# EAGLE design Shield_Release_181017 (EAGLE 7.1.0)
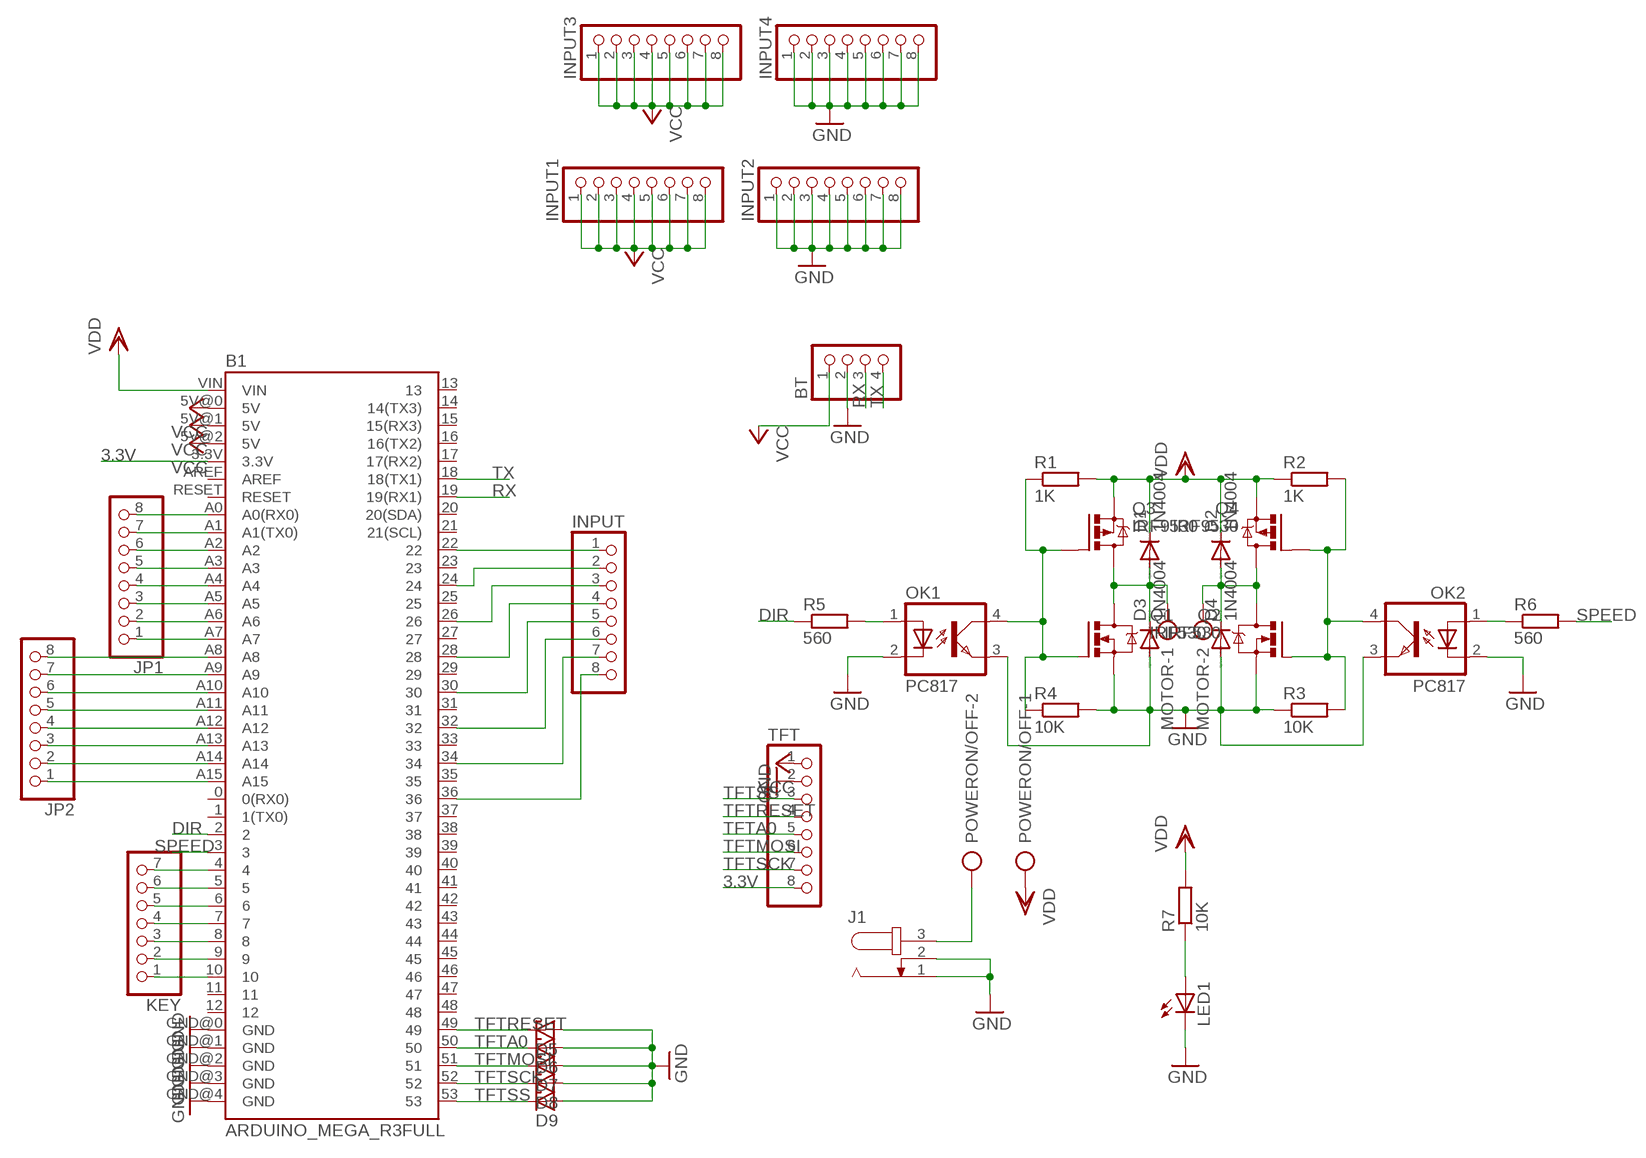
[diagram p0: schematic, sheet 1]

## Parts
B1  ARDUINO_MEGA_R3FULL  [ARDUINO_MEGA]
BT  PINHD-1X4  [1X04]
D1  1N4004  [DO41-10]
D2  1N4004  [DO41-10]
D3  1N4004  [DO41-10]
D4  1N4004  [DO41-10]
D5  ZENER-DIODEDO41Z10  [DO41Z10]
D6  ZENER-DIODEDO41Z10  [DO41Z10]
D7  ZENER-DIODEDO41Z10  [DO41Z10]
D8  ZENER-DIODEDO41Z10  [DO41Z10]
D9  ZENER-DIODEDO41Z10  [DO41Z10]
INPUT  PINHD-1X8  [1X08]
INPUT1  PINHD-1X8  [1X08]
INPUT2  PINHD-1X8  [1X08]
INPUT3  PINHD-1X8  [1X08]
INPUT4  PINHD-1X8  [1X08]
J1  JACK-PLUG0  [SPC4077]
JP1  PINHD-1X8  [1X08]
JP2  PINHD-1X8  [1X08]
KEY  PINHD-1X7  [1X07]
LED1  LED5MM  [LED5MM]
MOTOR  AK300/2  [AK300/2]
OK1  PC817  [DIL04]
OK2  PC817  [DIL04]
POWERON/OFF  AK300/2  [AK300/2]
Q1  IRF530  [TO220BV]
Q2  IRF530  [TO220BV]
Q3  IRF9530  [TO220BV]
Q4  IRF9530  [TO220BV]
R1  1K  R-EU_0204/7  [0204/7]
R2  1K  R-EU_0204/7  [0204/7]
R3  10K  R-EU_0204/7  [0204/7]
R4  10K  R-EU_0204/7  [0204/7]
R5  560  R-EU_0204/7  [0204/7]
R6  560  R-EU_0204/7  [0204/7]
R7  10K  R-EU_0204/7  [0204/7]
TFT  PINHD-1X8  [1X08]

## Nets
3.3V: B1.3.3V TFT.8
DIR: B1.2 R5.1
GND: B1.GND@0(GND) B1.GND@1(GND) B1.GND@2(GND) B1.GND@3(GND) B1.GND@4(GND) BT.2 D3.A D4.A D5.A D6.A D7.A D8.A D9.A INPUT2.1 INPUT2.2 INPUT2.3 INPUT2.4 INPUT2.5 INPUT2.6 INPUT2.7 INPUT2.8 INPUT4.1 INPUT4.2 INPUT4.3 INPUT4.4 INPUT4.5 INPUT4.6 INPUT4.7 INPUT4.8 J1.1 J1.2 LED1.K(C) OK1.2(C) OK1.3(EMIT) OK2.2(C) OK2.3(EMIT) Q1.S Q2.S R3.1 R4.2 TFT.2
N$1: OK1.4(COL) Q1.G Q3.G R1.1 R4.1
N$2: OK1.1(A) R5.2
N$3: OK2.1(A) R6.1
N$4: OK2.4(COL) Q2.G Q4.G R2.2 R3.2
N$5: B1.10 KEY.1
N$6: B1.9 KEY.2
N$7: D1.A D3.C MOTOR.1 Q1.D Q3.D
N$8: D2.A D4.C MOTOR.2 Q2.D Q4.D
N$9: B1.8 KEY.3
N$10: B1.7 KEY.4
N$11: B1.6 KEY.5
N$12: B1.5 KEY.6
N$13: B1.4 KEY.7
N$14: B1.A7 JP1.1
N$15: B1.A6 JP1.2
N$16: B1.A5 JP1.3
N$17: B1.A4 JP1.4
N$18: B1.A3 JP1.5
N$19: B1.A2 JP1.6
N$20: B1.A1(A1(TX0)) JP1.7
N$21: B1.A0(A0(RX0)) JP1.8
N$22: B1.A15 JP2.1
N$23: B1.A14 JP2.2
N$24: B1.A13 JP2.3
N$25: B1.A12 JP2.4
N$26: B1.A11 JP2.5
N$27: B1.A10 JP2.6
N$28: B1.A9 JP2.7
N$29: B1.A8 JP2.8
N$30: B1.22 INPUT.1
N$31: B1.24 INPUT.2
N$32: B1.26 INPUT.3
N$33: B1.28 INPUT.4
N$34: B1.30 INPUT.5
N$35: B1.32 INPUT.6
N$36: B1.34 INPUT.7
N$37: B1.36 INPUT.8
N$38: J1.3 POWERON/OFF.2
N$39: LED1.A R7.1
RX: B1.19(19(RX1)) BT.3
SPEED: B1.3 R6.2
TFTA0: B1.50 D6.C TFT.5
TFTMOSI: B1.51 D7.C TFT.6
TFTRESET: B1.49 D5.C TFT.4
TFTSCK: B1.52 D8.C TFT.7
TFTSS: B1.53 D9.C TFT.3
TX: B1.18(18(TX1)) BT.4
VCC: B1.5V@0(5V) B1.5V@1(5V) B1.5V@2(5V) BT.1 INPUT1.1 INPUT1.2 INPUT1.3 INPUT1.4 INPUT1.5 INPUT1.6 INPUT1.7 INPUT1.8 INPUT3.1 INPUT3.2 INPUT3.3 INPUT3.4 INPUT3.5 INPUT3.6 INPUT3.7 INPUT3.8 TFT.1
VDD: B1.VIN D1.C D2.C POWERON/OFF.1 Q3.S Q4.S R1.2 R2.1 R7.2
Unconnected: B1.0(0(RX0)) B1.1(1(TX0)) B1.11 B1.12 B1.13 B1.14(14(TX3)) B1.15(15(RX3)) B1.16(16(TX2)) B1.17(17(RX2)) B1.20(20(SDA)) B1.21(21(SCL)) B1.23 B1.25 B1.27 B1.29 B1.31 B1.33 B1.35 B1.37 B1.38 B1.39 B1.40 B1.41 B1.42 B1.43 B1.44 B1.45 B1.46 B1.47 B1.48 B1.AREF B1.RESET

## Library data of the parts
B1 = SparkFun-Boards:ARDUINO_MEGA_R3: Arduino Mega R3 ATmega2560 R3 compatible footprint. SparkFun Products: Arduino Mega 2560 R3 <https://www.sparkfun.com/products/11061>
BT = pinhead:PINHD-1X4: PIN HEADER
D1-D4 = diode:1N4004: DIODE general purpose rectifier, 1 A
D5-D9 = diode:ZENER-DIODE: Z-Diode
INPUT INPUT1-INPUT4 JP1 JP2 TFT = pinhead:PINHD-1X8: PIN HEADER
J1 = con-jack:JACK-PLUG: DC POWER JACK Power Jack, DC, Right Angle, Through Hole, Rated 5A at 16VDC, PC Terminals Distributor: Farnell (www.Farnell.de) Drawing: 84N1161.pdf / 84N1162.pdf Manufacturer: SPC Technology (www.spctechnology.com) Type: SPC4077 / SPC 4078; OC_FARNELL: unknown; OC_NEWARK: unknown
KEY = pinhead:PINHD-1X7: PIN HEADER
LED1 = led:LED: LED OSRAM: - CHIPLED LG R971, LG N971, LY N971, LG Q971, LY Q971, LO R971, LY R971 LH N974, LH R974 LS Q976, LO Q976, LY Q976 LO Q996 - Hyper CHIPLED LW Q18S LB Q993, LB Q99A, LB R99A - SideLED LS A670, LO A670, LY A670, LG A670, LP A670 LB A673, LV A673, LT A673, LW A673 LH A674 LY A675 LS A676, LA A676, LO A676, LY A676, LW A676 LS A679, LY A679, LG A679 - Hyper Micro SIDELED® LS Y876, LA Y876, LO Y876, LY Y876 LT Y87S - SmartLED LW L88C, LW L88S LB L89C, LB L89S, LG L890 LS L89K, LO L89K, LY L89K LS L896, LA L896, LO L896, LY L896 - TOPLED LS T670, LO T670, LY T670, LG T670, LP T670 LSG T670, LSP T670, LSY T670, LOP T670, LYG T670 LG T671, LOG T671, LSG T671 LB T673, LV T673, LT T673, LW T673 LH T674 LS T676, LA T676, LO T676, LY T676, LB T676, LH T676, LSB T676, LW T676 LB T67C, LV T67C, LT T67C, LS T67K, LO T67K, LY T67K, LW E67C LS E67B, LA E67B, LO E67B, LY E67B, LB E67C, LV E67C, LT E67C LW T67C LS T679, LY T679, LG T679 LS T770, LO T770, LY T770, LG T770, LP T770 LB T773, LV T773, LT T773, LW T773 LH T774 LS E675, LA E675, LY E675, LS T675 LS T776, LA T776, LO T776, LY T776, LB T776 LHGB T686 LT T68C, LB T68C - Hyper Mini TOPLED® LB M676 - Mini TOPLED Santana® LG M470 LS M47K, LO M47K, LY M47K Source: http://www.osram.convergy.de LUXEON: - LUMILED® LXK2-PW12-R00, LXK2-PW12-S00, LXK2-PW14-U00, LXK2-PW14-V00 LXK2-PM12-R00, LXK2-PM12-S00, LXK2-PM14-U00 LXK2-PE12-Q00, LXK2-PE12-R00, LXK2-PE12-S00, LXK2-PE14-T00, LXK2-PE14-U00 LXK2-PB12-K00, LXK2-PB12-L00, LXK2-PB12-M00, LXK2-PB14-N00, LXK2-PB14-P00, LXK2-PB14-Q00 LXK2-PR12-L00, LXK2-PR12-M00, LXK2-PR14-Q00, LXK2-PR14-R00 LXK2-PD12-Q00, LXK2-PD12-R00, LXK2-PD12-S00 LXK2-PH12-R00, LXK2-PH12-S00 LXK2-PL12-P00, LXK2-PL12-Q00, LXK2-PL12-R00 Source: www.luxeon.com KINGBRIGHT: KA-3528ASYC Source: www.kingbright.com
MOTOR POWERON/OFF = con-ptr500:AK300/2: CONNECTOR; OC_FARNELL: unknown; OC_NEWARK: unknown
OK1 OK2 = optocoupler:PC817: SHARP OPTO COUPLER; MPN: PC817X4J000F; OC_FARNELL: 9707727; OC_NEWARK: 97K7059
Q1 Q2 = transistor-power:IRF530: HEXFET Power MOSFET
Q3 Q4 = transistor-power:IRF9530: P-CHANNEL HEXFET POWER-MOS-FET Source: http://www.irf.com/product-info/datasheets/data/irf9530.pdf
R1-R7 = rcl:R-EU_: RESISTOR, European symbol

## Board
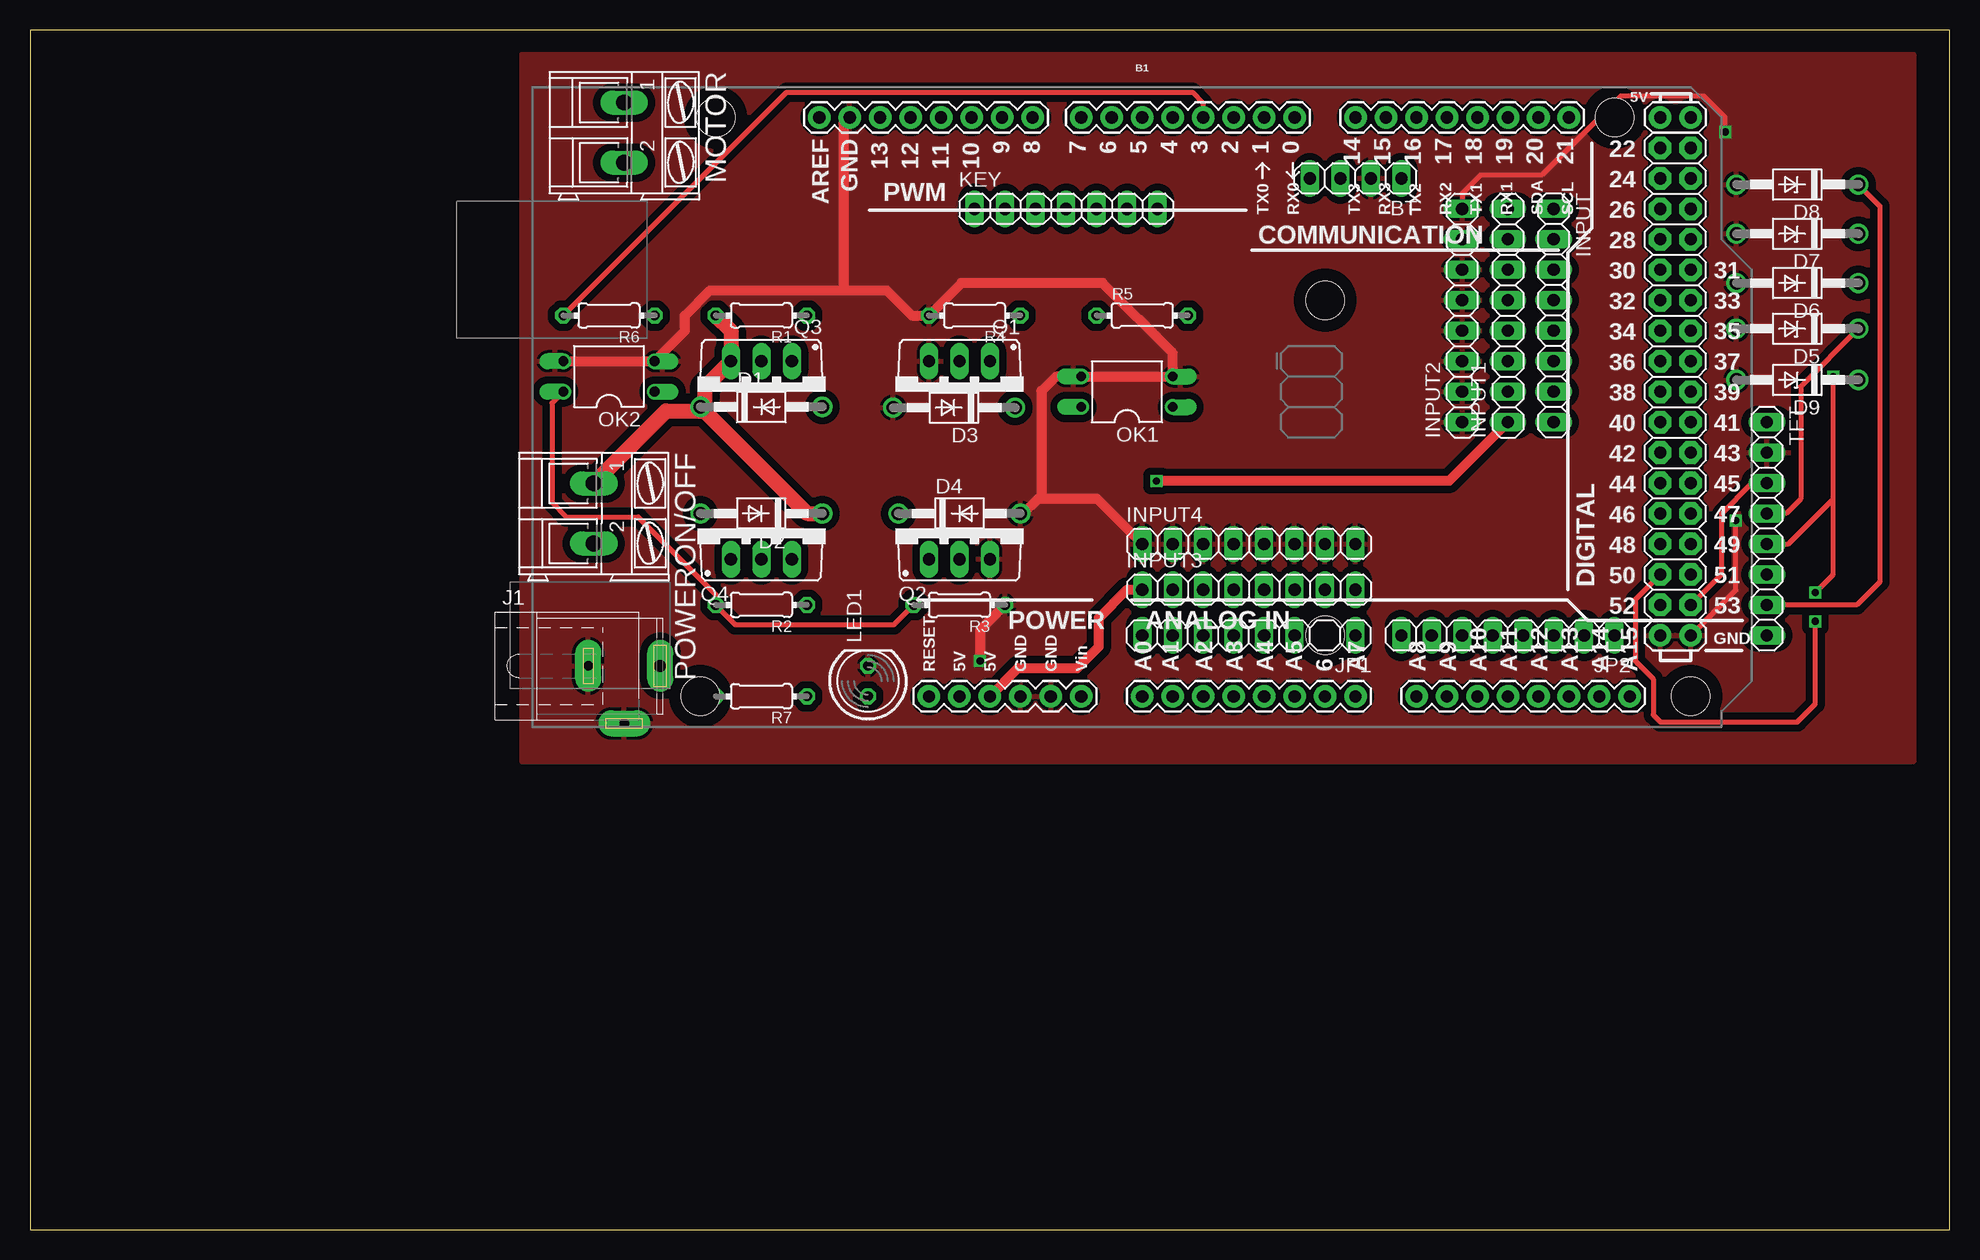
[diagram p1: board, top side]
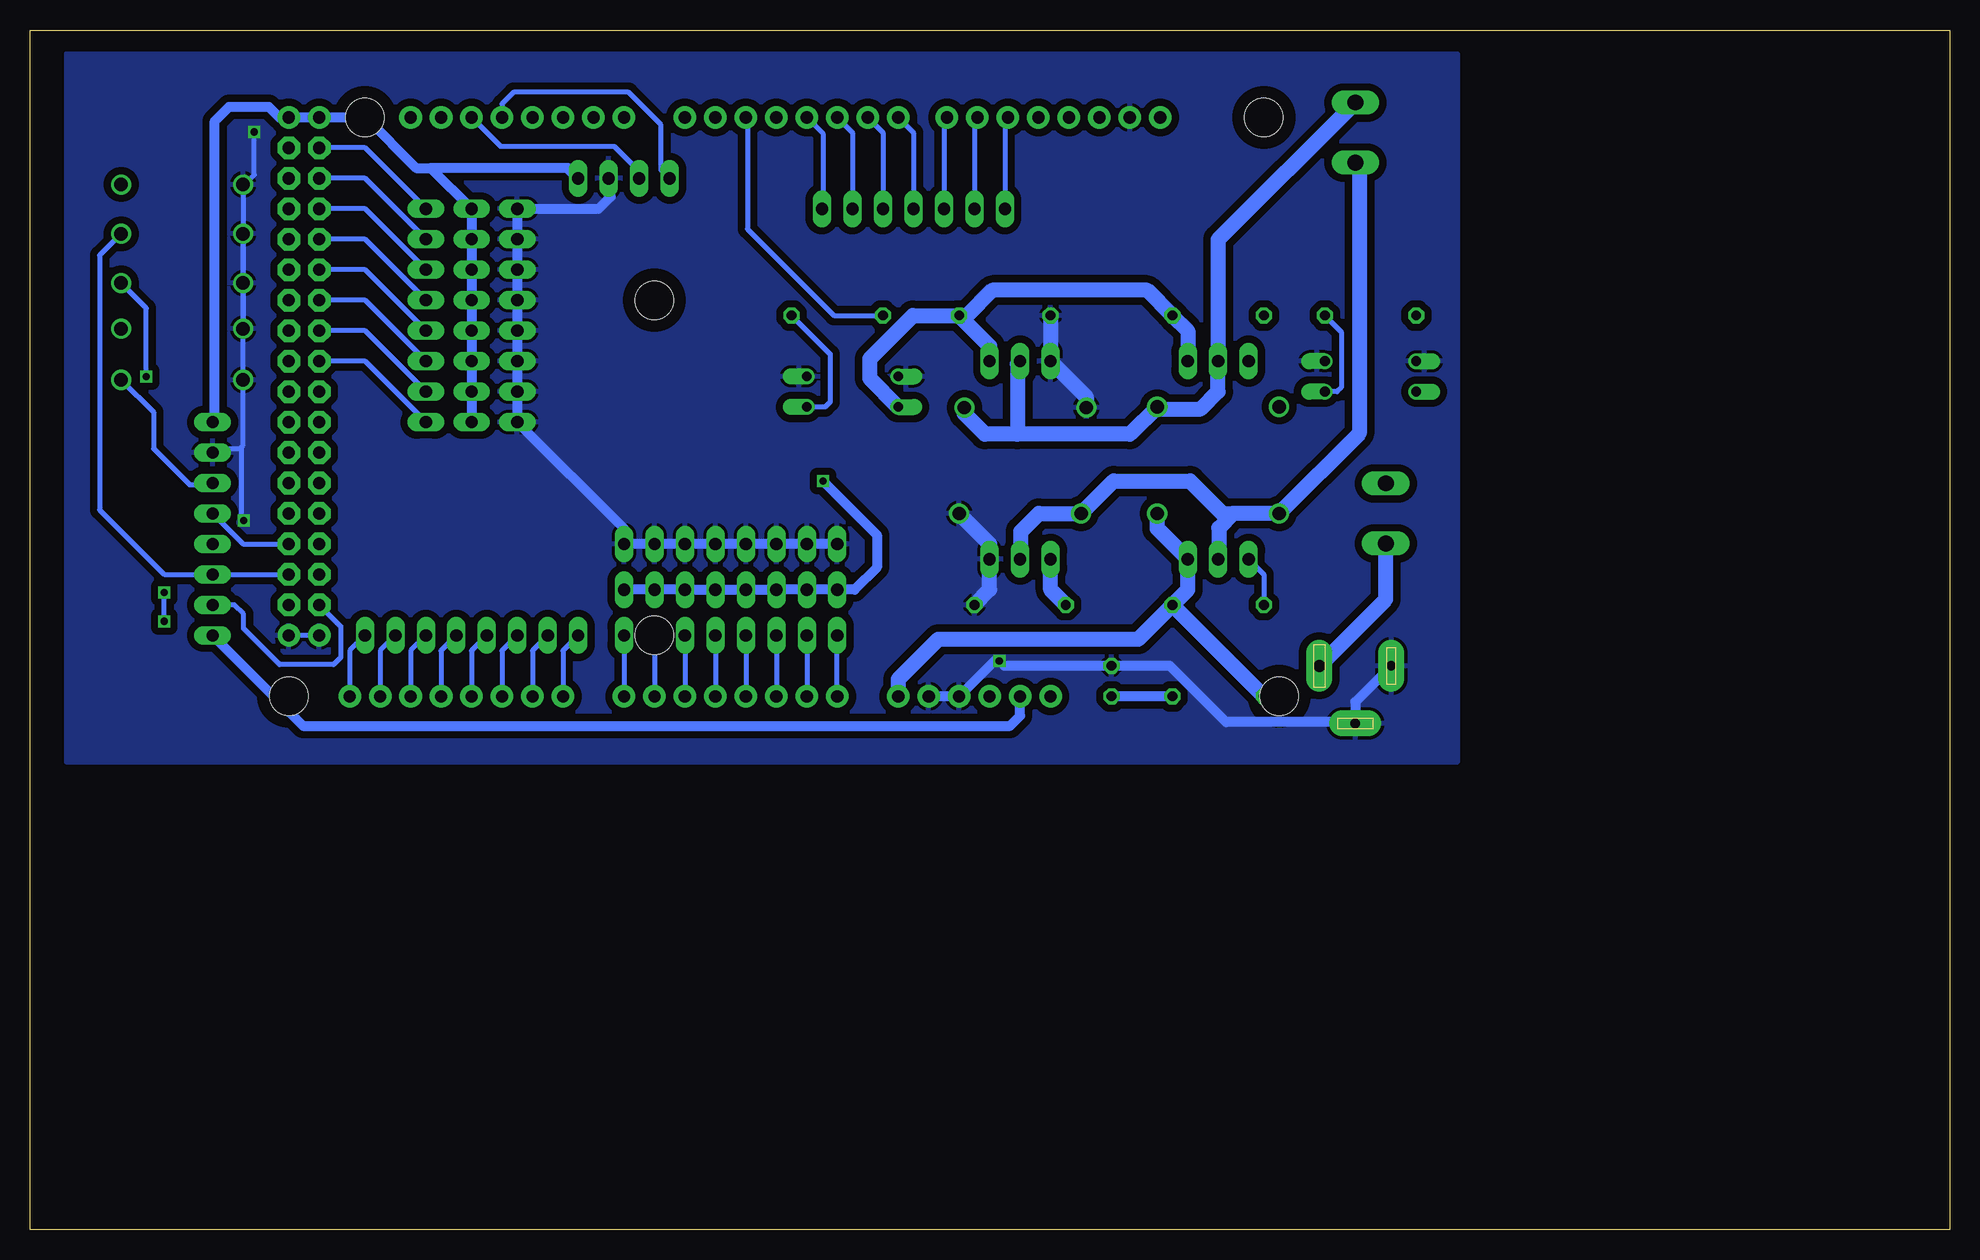
[diagram p2: board, bottom side, seen from below]

Size 160 x 100 mm. Coordinates in mm from the lower left corner, seen from the top.
Outline: 0,0 160,0 160,100 0,100 0,0
Copper layers (1*16): Top 0.035mm / dielectric 1.5mm / Bottom 0.035mm
Design rules "default": minimum track width 10mil, minimum drill 24mil, track to track 8mil, track to pad 8mil, pad to pad 8mil, via to via 8mil, smd to smd 8mil, copper to edge 40mil, drill to drill 8mil, minimum pad ring 10mil, minimum via ring 8mil, stop-mask expansion 4mil, vias tented up to drill 0mil, thermal gap 10mil

### Footprints (pad centres in the part's own frame; a part is rotated, then mirrored left to right if it is on the bottom)
ARDUINO_MEGA = drill 1.016 pad 1.88: 0 13.97,24.13; 1 11.43,24.13; 2 8.89,24.13; 3 6.35,24.13; 3.3V -13.97,-24.13; 4 3.81,24.13; 5 1.27,24.13; 5V@0 -11.43,-24.13; 5V@1 44.45,24.13; 5V@2 46.99,24.13; 6 -1.27,24.13; 7 -3.81,24.13; 8 -7.874,24.13; 9 -10.414,24.13; 10 -12.954,24.13; 11 -15.494,24.13; 12 -18.034,24.13; 13 -20.574,24.13; 14 19.05,24.13; 15 21.59,24.13; 16 24.13,24.13; 17 26.67,24.13; 18 29.21,24.13; 19 31.75,24.13; 20 34.29,24.13; 21 36.83,24.13; A0 1.27,-24.13; A1 3.81,-24.13; A2 6.35,-24.13; A3 8.89,-24.13; A4 11.43,-24.13; A5 13.97,-24.13; A6 16.51,-24.13; A7 19.05,-24.13; A8 24.13,-24.13; A9 26.67,-24.13; A10 29.21,-24.13; A11 31.75,-24.13; A12 34.29,-24.13; A13 36.83,-24.13; A14 39.37,-24.13; A15 41.91,-24.13; AREF -25.654,24.13; GND@0 -8.89,-24.13; GND@1 -6.35,-24.13; GND@2 44.45,-19.05; GND@3 46.99,-19.05; GND@4 -23.114,24.13; RESET -16.51,-24.13; VIN -3.81,-24.13 | drill 1.016 pad 1.88 octagon: 22 44.45,21.59; 23 46.99,21.59; 24 44.45,19.05; 25 46.99,19.05; 26 44.45,16.51; 27 46.99,16.51; 28 44.45,13.97; 29 46.99,13.97; 30 44.45,11.43; 31 46.99,11.43; 32 44.45,8.89; 33 46.99,8.89; 34 44.45,6.35; 35 46.99,6.35; 36 44.45,3.81; 37 46.99,3.81; 38 44.45,1.27; 39 46.99,1.27; 40 44.45,-1.27; 41 46.99,-1.27; 42 44.45,-3.81; 43 46.99,-3.81; 44 44.45,-6.35; 45 46.99,-6.35; 46 44.45,-8.89; 47 46.99,-8.89; 48 44.45,-11.43; 49 46.99,-11.43; 50 44.45,-13.97; 51 46.99,-13.97; 52 44.45,-16.51; 53 46.99,-16.51 | hole 3.2: -34.29,24.13; -35.56,-24.13; 16.51,8.89; 16.51,-19.05; 40.64,24.13; 46.99,-24.13
1X04 = drill 1.016 long: 1 -3.81,0; 2 -1.27,0; 3 1.27,0; 4 3.81,0
DO41-10 = drill 1.118: A 5.08,0; C -5.08,0
DO41Z10 = drill 1.118: A 5.08,0; C -5.08,0
1X08 = drill 1.016 long: 1 -8.89,0; 2 -6.35,0; 3 -3.81,0; 4 -1.27,0; 5 1.27,0; 6 3.81,0; 7 6.35,0; 8 8.89,0
SPC4077 = drill 0.8 pad 2.184 long: 1 -3,0; 2 0,-4.8 | drill 1 pad 2.184 long: 3 3,0
1X07 = drill 1.016 long: 1 -7.62,0; 2 -5.08,0; 3 -2.54,0; 4 0,0; 5 2.54,0; 6 5.08,0; 7 7.62,0
LED5MM = drill 0.813 octagon: A -1.27,0; K 1.27,0
AK300/2 = drill 1.321 long: 1 -2.515,0; 2 2.489,0
DIL04 = drill 0.813 offset: 1 -1.27,-3.81; 2 1.27,-3.81; 3 1.27,3.81; 4 -1.27,3.81
TO220BV = drill 1.016 long: D 0,-2.54; G -2.54,-2.54; S 2.54,-2.54
0204/7 = drill 0.813 octagon: 1 -3.81,0; 2 3.81,0

### Placement (x,y rotation side)
B1  91.44,68.58 0 top
BT  110.49,87.63 180 top
D1  60.96,68.58 0 top
D2  60.96,59.69 180 top
D3  77.03,68.52 180 top
D4  77.47,59.69 0 top
D5  147.32,75.09 180 top
D6  147.32,78.9 180 top
D7  147.32,83.01 180 top
D8  147.32,87.12 180 top
D9  147.32,70.83 180 top
INPUT  127,76.2 270 top
INPUT1  123.19,76.2 90 top
INPUT2  119.38,76.2 90 top
INPUT3  101.6,53.34 0 top
INPUT4  101.6,57.15 0 top
J1  49.53,46.99 0 top
JP1  101.6,49.53 180 top
JP2  123.19,49.53 180 top
KEY  86.36,85.09 0 top
LED1  69.85,45.72 90 top
MOTOR  49.53,91.44 270 top
OK1  91.44,69.85 90 top
OK2  48.26,71.12 90 top
POWERON/OFF  46.99,59.69 270 top
Q1  77.47,69.85 180 top
Q2  77.47,58.42 0 top
Q3  60.96,69.85 180 top
Q4  60.96,58.42 0 top
R1  60.96,76.2 180 top
R2  60.96,52.07 180 top
R3  77.47,52.07 180 top
R4  78.74,76.2 180 top
R5  92.71,76.2 0 top
R6  48.26,76.2 180 top
R7  60.96,44.45 180 top
TFT  144.78,58.42 270 top

### Tracks (layer width: path | path; a pad name or v marks a point on that pad's centre or on a via)
3.3V
  Bottom 0.813: TFT.8 137.25,42 78.3,42 77.47,42.83 B1.3.3V
DIR
  Bottom 0.406: B1.2 100.2,92.58 100.2,83.4 93,76.2 R5.1
GND  (via drill 0.6)
  Top 0.406: v141.3,91.5 141.3,92.7 139.5,94.5 132.6,94.5 126,87.9 120.9,87.9 119.38,86.38 INPUT2.8 119.38,84.6 | B1.GND@3 142.2,53.3 v142.2,59.1
  Top 0.813: R3.1 79.2,49.99 v79.2,47.4 | OK2.3 OK2.2 54.6,74.92 54.6,76.2 56.7,78.3 67.8,78.3 | 67.8,78.3 71.4,78.3 73.5,76.2 R4.2 77.63,78.9 89.4,78.9 95.25,73.05 OK1.2 OK1.3 87.63,71.1 85.5,71.1 84.3,69.9 84.3,61.2 84,60.9 | B1.GND@4 67.8,92.18 67.8,78.3 | 84,60.9 82.79,59.69 D4.A | INPUT4.1 88.96,60.9 84,60.9
  Bottom 0.406: B1.GND@2 B1.GND@3 | D8.A D7.A D6.A D5.A | D5.A D9.A 142.24,65.36 142.35,65.25 | TFT.2 144.45,65.1 142.5,65.1 142.35,65.25 | D5.A 142.2,75.13 142.2,87 141.3,87.9 v141.3,91.5 | v142.2,59.1 142.35,59.25 142.35,65.25
  Bottom 0.813: J1.1 49.53,43.99 J1.2 49.64,42.3 60.3,42.3 64.99,46.99 LED1.K 78.79,46.99 v79.2,47.4 79.6,47.4 B1.GND@0 B1.GND@1 | INPUT4.1 INPUT4.2 INPUT4.3 INPUT4.4 INPUT4.5 INPUT4.6 INPUT4.7 INPUT4.8 110.49,58.42 INPUT2.1 INPUT2.2 INPUT2.3 INPUT2.4 INPUT2.5 INPUT2.6 INPUT2.7 INPUT2.8 112.61,85.09 111.6,86.1 111.6,87.47 BT.2
  Bottom 1.27: D4.A 80.01,57.15 Q2.S 80.01,53.34 R3.1 | D3.A 71.95,69.41 Q1.S R4.2
  pour Bottom (isolate 0.61): 41,98 157,98 157,39 41,39
  pour Top (isolate 0.61): 41,98 157,98 157,39 41,39
N$1
  Bottom 1.27: Q3.G 63.5,74.93 R1.1 66.87,78.3 79.8,78.3 81.9,76.2 R4.1 | R4.1 80.01,73.66 Q1.G | OK1.4 90,70.95 90,72.6 86.4,76.2 R4.1
N$2
  Bottom 0.406: R5.2 93.3,72.98 93.3,69 93.72,68.58 OK1.1
N$3
  Bottom 0.406: R6.1 50.7,74.83 50.7,70.2 51.05,69.85 OK2.1
N$4
  Top 0.406: R3.2 71.99,50.4 58.8,50.4 57.15,52.05 R2.2 57.15,52.95 50.7,59.4 44.7,59.4 43.5,60.6 43.5,68.9 OK2.4
  Bottom 0.406: Q4.G 57.15,54.61 R2.2
  Bottom 1.27: R3.2 74.93,53.34 Q2.G
N$5
  Bottom 0.406: B1.10 78.74,92.46 KEY.1
N$6
  Bottom 0.406: B1.9 81.28,92.46 KEY.2
N$7
  Bottom 1.27: MOTOR.1 60.96,82.53 Q3.D 60.96,69.84 62.4,68.4 65.86,68.4 D1.A 68.32,66.3 77.7,66.3 | 77.7,66.3 80.4,66.3 82.11,68.01 D3.C | Q1.D 77.7,72.16 77.7,66.3
N$8
  Bottom 1.27: MOTOR.2 49.2,88.62 49.2,66.37 D2.A 59.71,59.69 | 59.71,59.69 60.9,58.5 60.9,55.94 Q4.D | 59.71,59.69 60.59,59.69 63.3,62.4 69.68,62.4 D4.C 75.91,59.69 77.4,58.2 77.4,55.95 Q2.D
N$9
  Bottom 0.406: B1.8 83.82,92.46 KEY.3
N$10
  Bottom 0.406: B1.7 86.36,91.44 KEY.4
N$11
  Bottom 0.406: B1.6 88.9,91.44 KEY.5
N$12
  Bottom 0.406: B1.5 91.44,91.44 KEY.6
N$13
  Bottom 0.406: B1.4 93.9,91.36 93.9,85.8 93.98,85.72 KEY.7
N$14
  Bottom 0.406: JP1.1 B1.A7
N$15
  Bottom 0.406: JP1.2 B1.A6
N$16
  Bottom 0.406: JP1.3 B1.A5
N$17
  Bottom 0.406: JP1.4 B1.A4
N$18
  Bottom 0.406: JP1.5 B1.A3
N$19
  Bottom 0.406: JP1.6 B1.A2
N$20
  Bottom 0.406: JP1.7 B1.A1
N$21
  Bottom 0.406: B1.A0 JP1.8
N$22
  Bottom 0.406: JP2.1 133.35,48.26 B1.A15
N$23
  Bottom 0.406: JP2.2 130.81,48.26 B1.A14
N$24
  Bottom 0.406: JP2.3 128.27,48.26 B1.A13
N$25
  Bottom 0.406: JP2.4 125.73,48.26 B1.A12
N$26
  Bottom 0.406: JP2.5 123.19,48.26 B1.A11
N$27
  Bottom 0.406: JP2.6 120.65,48.26 B1.A10
N$28
  Bottom 0.406: JP2.7 118.11,48.26 B1.A9
N$29
  Bottom 0.406: JP2.8 115.57,48.26 B1.A8
N$30
  Bottom 0.406: INPUT.1 132.08,90.17 B1.22
N$31
  Bottom 0.406: INPUT.2 132.08,87.63 B1.24
N$32
  Bottom 0.406: INPUT.3 132.08,85.09 B1.26
N$33
  Bottom 0.406: INPUT.4 132.08,82.55 B1.28
N$34
  Bottom 0.406: INPUT.5 132.08,80.01 B1.30
N$35
  Bottom 0.406: INPUT.6 132.08,77.47 B1.32
N$36
  Bottom 0.406: INPUT.7 132.08,74.93 B1.34
N$37
  Bottom 0.406: INPUT.8 132.08,72.39 B1.36
N$38
  Bottom 1.27: J1.3 46.99,52.53 POWERON/OFF.2
N$39
  Bottom 0.813: R7.1 LED1.A
RX
  Bottom 0.406: B1.19 120.78,90.3 111.3,90.3 109.22,88.22 BT.3
SPEED
  Top 0.406: R6.2 63.05,94.8 96.9,94.8 97.79,93.91 B1.3
TFTA0  (via drill 0.6)
  Top 0.406: TFT.5 146.55,57.15 150.3,60.9 | 150.3,60.9 v150.3,71.1 | B1.50 133.8,52.52 133.8,47.4 135.3,45.9 135.3,42.9 135.9,42.3 147.3,42.3 148.8,43.8 v148.8,50.7 | v148.8,53.1 150.3,54.6 150.3,60.9
  Bottom 0.406: v150.3,71.1 150.3,76.8 D6.C | v148.8,50.7 v148.8,53.1
TFTMOSI
  Bottom 0.406: B1.51 TFT.6 148.81,54.61 154.2,60 154.2,81.21 D7.C
TFTRESET
  Top 0.406: D5.C 147.6,70.29 147.6,60.9 146.39,59.69 TFT.4
  Bottom 0.406: TFT.4 142.24,57.15 B1.49
TFTSCK
  Top 0.406: D8.C 154.2,85.32 154.2,54 152.27,52.07 TFT.7
  Bottom 0.406: B1.52 134.1,50.28 134.1,47.7 134.7,47.1 139.2,47.1 142.2,50.1 142.2,51.3 142.97,52.07 TFT.7
TFTSS
  Top 0.406: B1.53 141,54.64 141,59.7 143.53,62.23 TFT.3
  Bottom 0.406: D9.C 149.7,68.13 149.7,65.1 146.7,62.1 145.5,62.1 145.37,62.23 TFT.3
TX
  Bottom 0.406: BT.4 107.4,88.35 107.4,92.1 110.1,94.8 119.7,94.8 120.65,93.85 B1.18
VCC  (via drill 0.6)
  Top 0.813: B1.5V@0 82.36,46.8 87.3,46.8 89.1,48.6 89.1,51 91.44,53.34 INPUT3.1 | INPUT1.1 118.28,62.4 v93.9,62.4
  Bottom 0.813: INPUT3.8 INPUT3.7 INPUT3.6 INPUT3.5 INPUT3.4 INPUT3.3 INPUT3.2 INPUT3.1 91.26,53.34 89.4,55.2 89.4,57.9 v93.9,62.4 | INPUT1.1 INPUT1.2 INPUT1.3 INPUT1.4 INPUT1.5 INPUT1.6 INPUT1.7 INPUT1.8 126.6,88.5 | 126.6,88.5 127.8,88.5 132.01,92.71 B1.5V@1 B1.5V@2 139.21,92.71 140.1,93.6 143.4,93.6 144.6,92.4 144.6,67.49 TFT.1 | BT.1 115.17,88.5 126.6,88.5
VDD
  Top 1.27: D1.C 56.23,68.23 | 56.23,68.23 64.77,59.69 D2.C | POWERON/OFF.1 53.02,68.23 56.23,68.23 | 56.23,68.23 56.23,70.2 Q3.S 58.42,74.93 R1.2
  Bottom 1.27: R2.1 63.5,53.34 Q4.S 66.04,58.42 D2.C | R7.2 R2.1 | R2.1 67.64,49.2 84.3,49.2 87.63,45.87 B1.VIN